# Altium schematic sheet Structure.SchDoc
size 420 x 297 mm; Address1: Address1; Address2: Address2; Address3: Address3; Address4: Address4; DocumentNumber: АБВГ.123456.001 Э3; SheetNumber: 1; Scale: 1:1; DocumentType: Схема электрическая принципиальная; FirstReferrence: АБВГ.123456.001
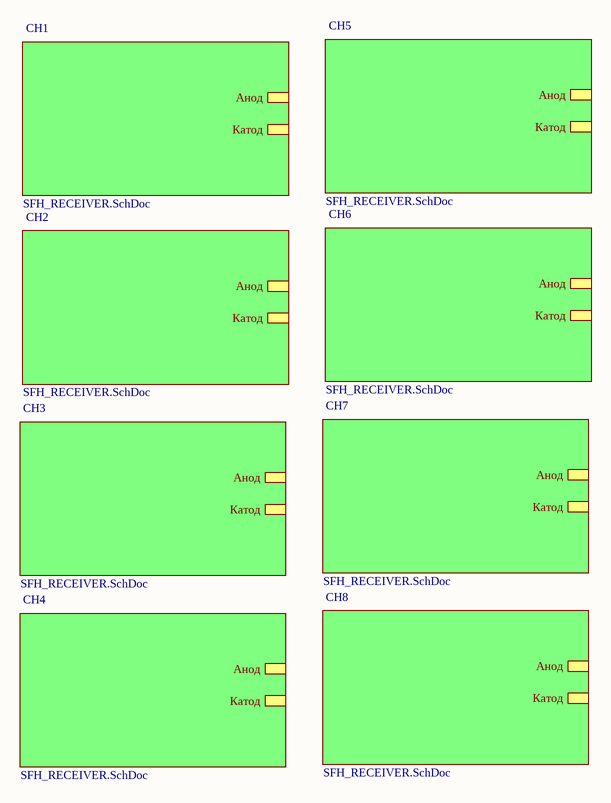
[diagram p0: Structure.SchDoc]

## Sub-sheets
CH1 = SFH_RECEIVER.SchDoc: Анод, Катод
CH2 = SFH_RECEIVER.SchDoc: Анод, Катод
CH3 = SFH_RECEIVER.SchDoc: Анод, Катод
CH4 = SFH_RECEIVER.SchDoc: Анод, Катод
CH5 = SFH_RECEIVER.SchDoc: Анод, Катод
CH6 = SFH_RECEIVER.SchDoc: Анод, Катод
CH7 = SFH_RECEIVER.SchDoc: Анод, Катод
CH8 = SFH_RECEIVER.SchDoc: Анод, Катод

## Notes on the sheet
- Перв. примен.
- Справ. №
- Подп. и дата
- Инв. № дубл.
- Взам. инв. №
- Разраб.
- Изм.
- Лист
- № докум.
- Подп.
- Дата
- Лит.
- Масса
- Масштаб
- Пров.
- Т.контр.
- Листов
- Инв. № подл.
- Утв.
- Н.контр.
- 2.106-A3
- Копировал
- Формат А3